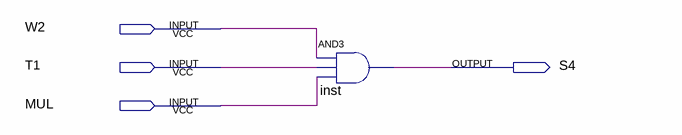
[diagram p0: schematic sheet]
// Quartus schematic S4.bdf as structural Verilog: 1 symbols, 4 pins
module S4 (
  input  W2,
  input  T1,
  input  MUL,
  output S4
);

  and inst (S4, W2, T1, MUL);
endmodule
